# EAGLE design MainBoardRev2 (EAGLE 9.6.2)

## Sheet 1 of 2: Schrittmotorsteuerung Hier wird die Schaltung für die Schrittmotortreiber aufgezeigt
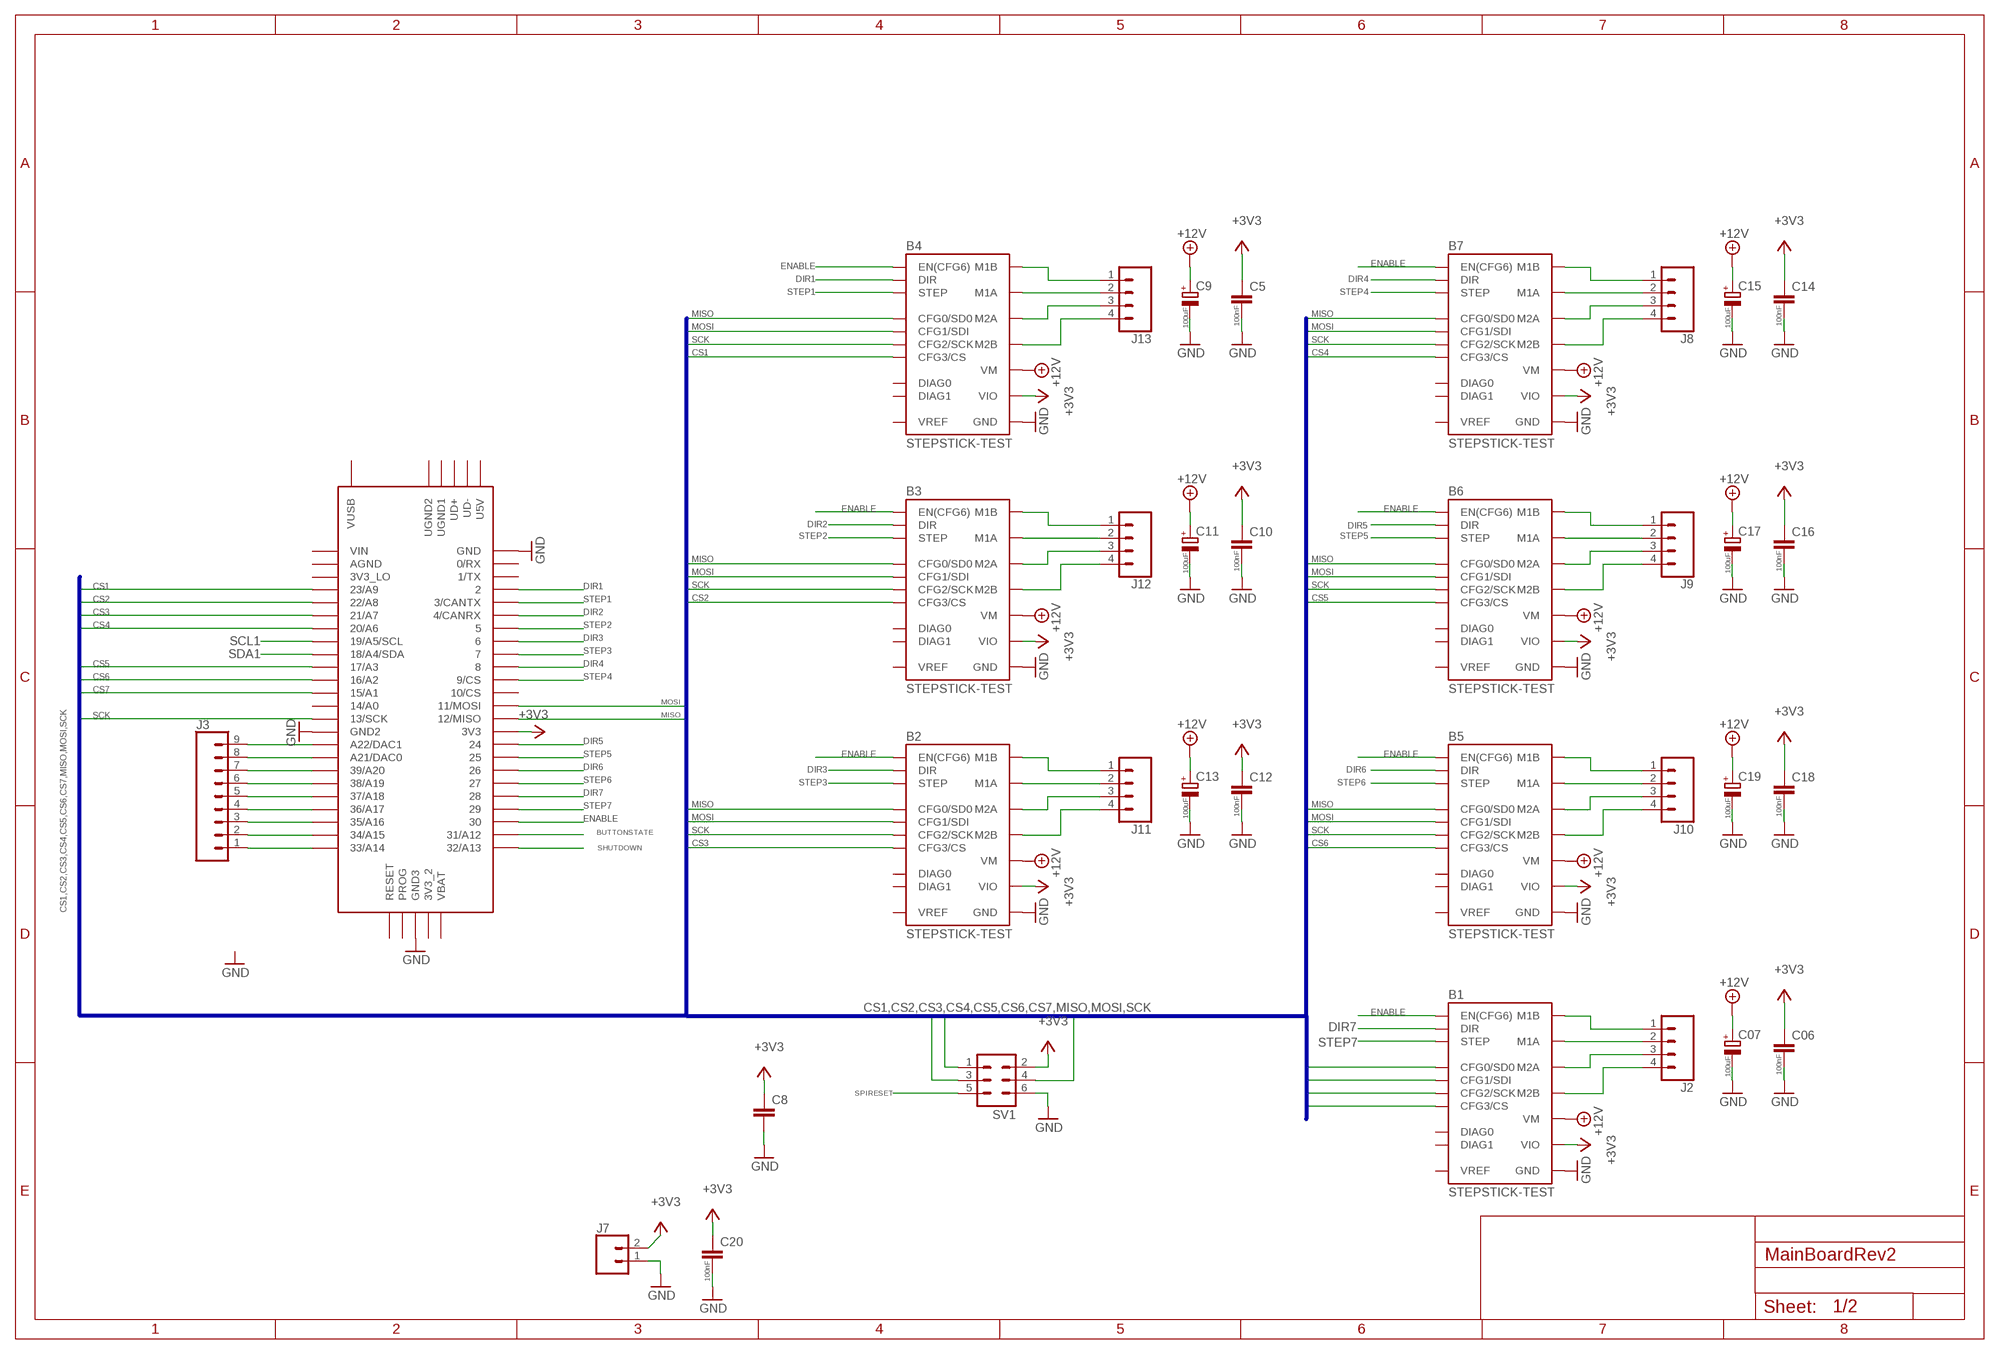
[diagram p0: schematic, sheet 1]

### Parts
B1  STEPSTICK-TEST  [STEPSTICK-TEST]
B2  STEPSTICK-TEST  [STEPSTICK-TEST]
B3  STEPSTICK-TEST  [STEPSTICK-TEST]
B4  STEPSTICK-TEST  [STEPSTICK-TEST]
B5  STEPSTICK-TEST  [STEPSTICK-TEST]
B6  STEPSTICK-TEST  [STEPSTICK-TEST]
B7  STEPSTICK-TEST  [STEPSTICK-TEST]
C5  100nF  C-EU050-024X044  [C050-024X044]
C06  100nF  C-EU050-024X044  [C050-024X044]
C07  100uF  CPOL-EUE2.5-6  [E2,5-6]
C8  C-EU050-024X044  [C050-024X044]
C9  100uF  CPOL-EUE2.5-6  [E2,5-6]
C10  100nF  C-EU050-024X044  [C050-024X044]
C11  100uF  CPOL-EUE2.5-6  [E2,5-6]
C12  100nF  C-EU050-024X044  [C050-024X044]
C13  100uF  CPOL-EUE2.5-6  [E2,5-6]
C14  100nF  C-EU050-024X044  [C050-024X044]
C15  100uF  CPOL-EUE2.5-6  [E2,5-6]
C16  100nF  C-EU050-024X044  [C050-024X044]
C17  100uF  CPOL-EUE2.5-6  [E2,5-6]
C18  100nF  C-EU050-024X044  [C050-024X044]
C19  100uF  CPOL-EUE2.5-6  [E2,5-6]
C20  100nF  C-EU050-024X044  [C050-024X044]
J2  CONN_041X04_NO_SILK  [1X04_NO_SILK]
J3  CONN_09LONGPADS  [1X09_LONGPADS]
J7  CONN_02PTH3  [1X02_LONGPADS]
J8  CONN_041X04_NO_SILK  [1X04_NO_SILK]
J9  CONN_041X04_NO_SILK  [1X04_NO_SILK]
J10  CONN_041X04_NO_SILK  [1X04_NO_SILK]
J11  CONN_041X04_NO_SILK  [1X04_NO_SILK]
J12  CONN_041X04_NO_SILK  [1X04_NO_SILK]
J13  CONN_041X04_NO_SILK  [1X04_NO_SILK]
SV1  MA03-2  [MA03-2]
U$1  TEENSY_4.1  [TEENSY_4.1]

### Nets
+3V3: B1.VIO B2.VIO B3.VIO B4.VIO B5.VIO B6.VIO B7.VIO C5.1 C06.1 C8.1 C10.1 C12.1 C14.1 C16.1 C18.1 C20.1 J7.2 SV1.2 U$1.3V3 ; also sheet 2
+12V: B1.VM B2.VM B3.VM B4.VM B5.VM B6.VM B7.VM C07.+ C9.+ C11.+ C13.+ C15.+ C17.+ C19.+ ; also sheet 2
BUTTONSTATE: U$1.31/A12 ; also sheet 2
CS1: B4.CFG3(CFG3/CS) U$1.23/A9
CS2: B3.CFG3(CFG3/CS) U$1.22/A8
CS3: B2.CFG3(CFG3/CS) U$1.21/A7
CS4: B7.CFG3(CFG3/CS) U$1.20/A6
CS5: B6.CFG3(CFG3/CS) U$1.17/A3
CS6: B5.CFG3(CFG3/CS) U$1.16/A2
CS7: B1.CFG3(CFG3/CS) U$1.15/A1
DIR1: B4.DIR U$1.2
DIR2: B3.DIR U$1.4/CANRX
DIR3: B2.DIR U$1.6
DIR4: B7.DIR U$1.8
DIR5: B6.DIR U$1.24/A10
DIR6: B5.DIR U$1.26/12
DIR7: B1.DIR U$1.28
ENABLE: B1.EN(EN(CFG6)) B2.EN(EN(CFG6)) B3.EN(EN(CFG6)) B4.EN(EN(CFG6)) B5.EN(EN(CFG6)) B6.EN(EN(CFG6)) B7.EN(EN(CFG6)) U$1.30
GND: B1.GND@1(GND) B1.GND@2(GND) B2.GND@1(GND) B2.GND@2(GND) B3.GND@1(GND) B3.GND@2(GND) B4.GND@1(GND) B4.GND@2(GND) B5.GND@1(GND) B5.GND@2(GND) B6.GND@1(GND) B6.GND@2(GND) B7.GND@1(GND) B7.GND@2(GND) C5.2 C06.2 C07.- C8.2 C9.- C10.2 C11.- C12.2 C13.- C14.2 C15.- C16.2 C17.- C18.2 C19.- C20.2 J7.1 SV1.6 U$1.GND U$1.GND2 U$1.GND3 ; also sheet 2
MISO: B1.NC/CFG0(CFG0/SD0) B2.NC/CFG0(CFG0/SD0) B3.NC/CFG0(CFG0/SD0) B4.NC/CFG0(CFG0/SD0) B5.NC/CFG0(CFG0/SD0) B6.NC/CFG0(CFG0/SD0) B7.NC/CFG0(CFG0/SD0) SV1.1 U$1.12/MISO
MOSI: B1.CFG1(CFG1/SDI) B2.CFG1(CFG1/SDI) B3.CFG1(CFG1/SDI) B4.CFG1(CFG1/SDI) B5.CFG1(CFG1/SDI) B6.CFG1(CFG1/SDI) B7.CFG1(CFG1/SDI) SV1.4 U$1.11/MOSI
N$1: B1.M2B J2.4
N$2: B1.M2A J2.3
N$3: B1.M1A J2.2
N$7: B1.M1B J2.1
N$8: J3.1 U$1.33/A14
N$9: J3.2 U$1.34/A15
N$10: J3.3 U$1.35/A16
N$11: J3.4 U$1.36/A17
N$12: J3.5 U$1.37/A18
N$13: J3.6 U$1.38/A19
N$14: B2.M2B J11.4
N$15: B2.M2A J11.3
N$16: B2.M1A J11.2
N$17: B2.M1B J11.1
N$18: B3.M2B J12.4
N$19: B3.M2A J12.3
N$20: B3.M1A J12.2
N$21: B3.M1B J12.1
N$22: B4.M2B J13.4
N$23: B4.M2A J13.3
N$24: B4.M1A J13.2
N$25: B4.M1B J13.1
N$26: B5.M2B J10.4
N$27: B5.M2A J10.3
N$28: B5.M1A J10.2
N$29: B5.M1B J10.1
N$30: B6.M2B J9.4
N$31: B6.M2A J9.3
N$32: B6.M1A J9.2
N$33: B6.M1B J9.1
N$34: B7.M2B J8.4
N$35: B7.M2A J8.3
N$36: B7.M1A J8.2
N$37: B7.M1B J8.1
N$38: J3.7 U$1.39/A20
N$39: J3.8 U$1.21/DAC0(A21/DAC0)
N$40: J3.9 U$1.A22/DAC1
SCK: B1.CFG2(CFG2/SCK) B2.CFG2(CFG2/SCK) B3.CFG2(CFG2/SCK) B4.CFG2(CFG2/SCK) B5.CFG2(CFG2/SCK) B6.CFG2(CFG2/SCK) B7.CFG2(CFG2/SCK) SV1.3 U$1.13/SCK
SCL1: U$1.19/A5/SCL ; also sheet 2
SDA1: U$1.18/A4/SDA ; also sheet 2
SHUTDOWN: U$1.32/A13 ; also sheet 2
SPIRESET: SV1.5
STEP1: B4.STEP U$1.3/CANTX
STEP2: B3.STEP U$1.5
STEP3: B2.STEP U$1.7
STEP4: B7.STEP U$1.9/CS
STEP5: B6.STEP U$1.25/A11
STEP6: B5.STEP U$1.27/A13
STEP7: B1.STEP U$1.29
Unconnected: B1.DIAG0 B1.DIAG1 B1.VREF B2.DIAG0 B2.DIAG1 B2.VREF B3.DIAG0 B3.DIAG1 B3.VREF B4.DIAG0 B4.DIAG1 B4.VREF B5.DIAG0 B5.DIAG1 B5.VREF B6.DIAG0 B6.DIAG1 B6.VREF B7.DIAG0 B7.DIAG1 B7.VREF U$1.0/RX U$1.1/TX U$1.3V3_2 U$1.3V3_LO U$1.10/CS U$1.14/A0 U$1.AGND U$1.PROG U$1.RESET U$1.U5V U$1.UD+ U$1.UD- U$1.UGND1 U$1.UGND2 U$1.VBAT U$1.VIN U$1.VUSB

### Buses
CS1,CS2,CS3,CS4,CS5,CS6,CS7,MISO,MOSI,SCK

## Sheet 2 of 2: Spannungsversorgung Hier wird das Powerup-Interface des Netzteils definiert
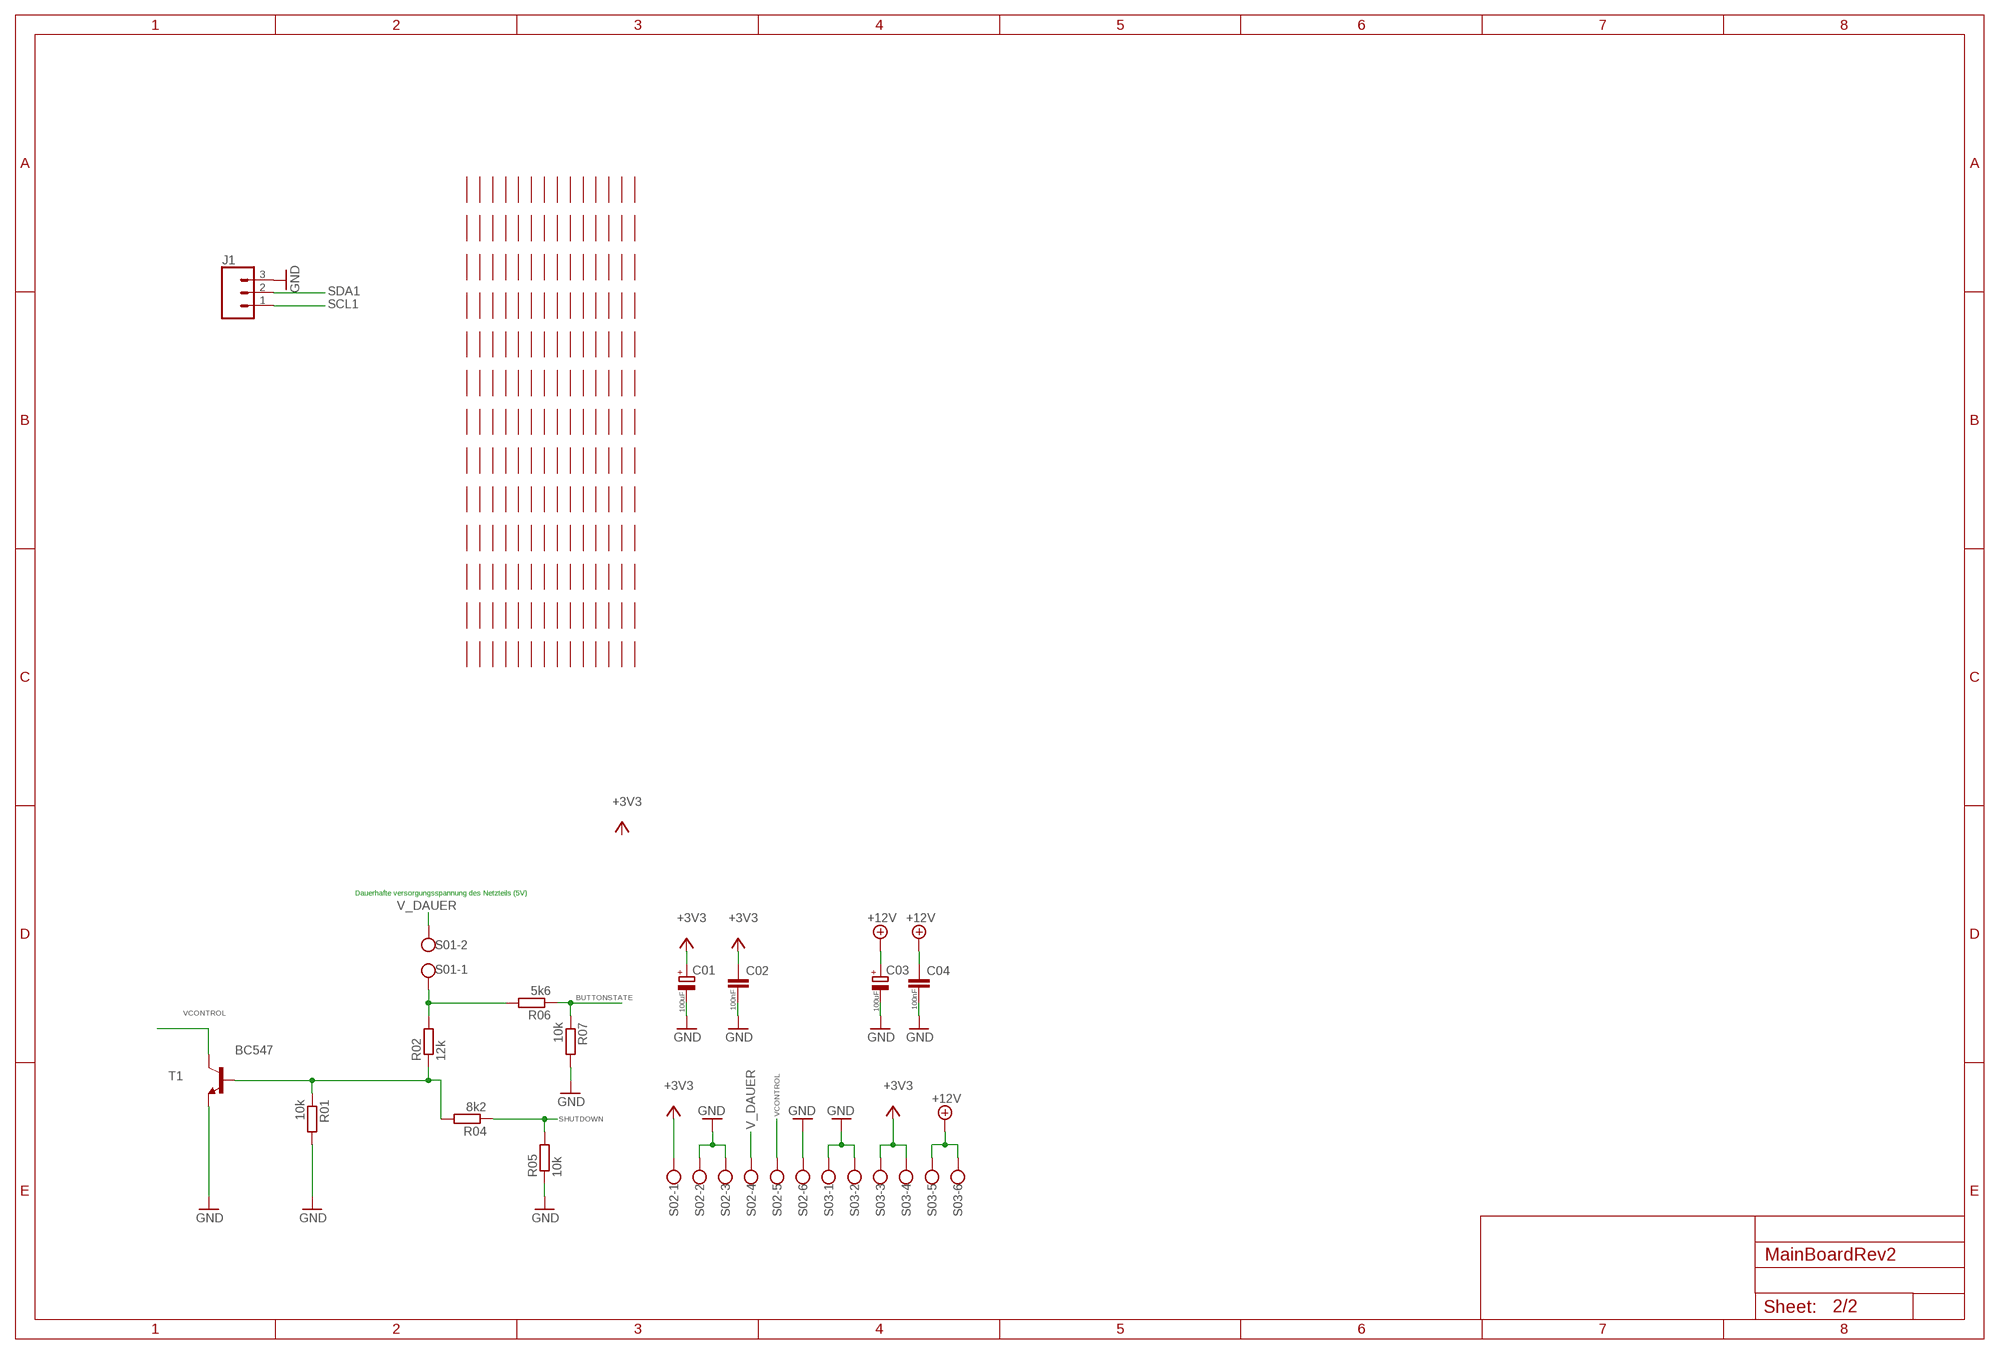
[diagram p1: schematic, sheet 2]

### Parts
C01  100uF  CPOL-EUE2.5-6  [E2,5-6]
C02  100nF  C-EU050-024X044  [C050-024X044]
C03  100uF  CPOL-EUE2.5-6  [E2,5-6]
C04  100nF  C-EU050-024X044  [C050-024X044]
J1  CONN_03LONGPADS  [1X03_LONGPADS]
R01  10k  R-EU_0207/10  [0207/10]
R02  12k  R-EU_0207/10  [0207/10]
R04  8k2  R-EU_0207/10  [0207/10]
R05  10k  R-EU_0207/10  [0207/10]
R06  5k6  R-EU_0207/10  [0207/10]
R07  10k  R-EU_0207/10  [0207/10]
S01  W237-102  [W237-102]
S02  W237-6  [W237-6]
S03  W237-6  [W237-6]
T1  BC547  [TO92]
U$2  LOCHRASTER  [LOCHRASTER]

### Nets
+3V3: C01.+ C02.1 S02.1 S03.3 S03.4 ; also sheet 1
+12V: C03.+ C04.1 S03.5 S03.6 ; also sheet 1
BUTTONSTATE: R06.1 R07.1 ; also sheet 1
GND: C01.- C02.2 C03.- C04.2 J1.3 R01.2 R05.1 R07.2 S02.2 S02.3 S02.6 S03.1 S03.2 T1.1(E) ; also sheet 1
N$5: R02.2 R06.2 S01.1
N$41: R01.1 R02.1 R04.2 T1.2(B)
SCL1: J1.1 ; also sheet 1
SDA1: J1.2 ; also sheet 1
SHUTDOWN: R04.1 R05.2 ; also sheet 1
V_DAUER: S01.2 S02.4
VCONTROL: S02.5 T1.3(C)
Unconnected: U$2.P$1 U$2.P$2 U$2.P$3 U$2.P$4 U$2.P$5 U$2.P$6 U$2.P$7 U$2.P$8 U$2.P$9 U$2.P$10 U$2.P$11 U$2.P$12 U$2.P$13 U$2.P$14 U$2.P$15 U$2.P$16 U$2.P$17 U$2.P$18 U$2.P$19 U$2.P$20 U$2.P$21 U$2.P$22 U$2.P$23 U$2.P$24 U$2.P$25 U$2.P$26 U$2.P$27 U$2.P$28 U$2.P$29 U$2.P$30 U$2.P$31 U$2.P$32 U$2.P$33 U$2.P$34 U$2.P$35 U$2.P$36 U$2.P$37 U$2.P$38 U$2.P$39 U$2.P$40 U$2.P$41 U$2.P$42 U$2.P$43 U$2.P$44 U$2.P$45 U$2.P$46 U$2.P$47 U$2.P$48 U$2.P$49 U$2.P$50 U$2.P$51 U$2.P$52 U$2.P$53 U$2.P$54 U$2.P$55 U$2.P$56 U$2.P$57 U$2.P$58 U$2.P$59 U$2.P$60 U$2.P$61 U$2.P$62 U$2.P$63 U$2.P$64 U$2.P$65 U$2.P$66 U$2.P$67 U$2.P$68 U$2.P$69 U$2.P$70 U$2.P$71 U$2.P$72 U$2.P$73 U$2.P$74 U$2.P$75 U$2.P$76 U$2.P$77 U$2.P$78 U$2.P$79 U$2.P$80 U$2.P$81 U$2.P$82 U$2.P$83 U$2.P$84 U$2.P$85 U$2.P$86 U$2.P$87 U$2.P$88 U$2.P$89 U$2.P$90 U$2.P$91 U$2.P$92 U$2.P$93 U$2.P$94 U$2.P$95 U$2.P$96 U$2.P$97 U$2.P$98 U$2.P$99 U$2.P$100 U$2.P$101 U$2.P$102 U$2.P$103 U$2.P$104 U$2.P$105 U$2.P$106 U$2.P$107 U$2.P$108 U$2.P$109 U$2.P$110 U$2.P$111 U$2.P$112 U$2.P$113 U$2.P$114 U$2.P$115 U$2.P$116 U$2.P$117 U$2.P$118 U$2.P$119 U$2.P$120 U$2.P$121 U$2.P$122 U$2.P$123 U$2.P$124 U$2.P$125 U$2.P$126 U$2.P$127 U$2.P$128 U$2.P$129 U$2.P$130 U$2.P$131 U$2.P$132 U$2.P$133 U$2.P$134 U$2.P$135 U$2.P$136 U$2.P$137 U$2.P$138 U$2.P$139 U$2.P$140 U$2.P$141 U$2.P$142 U$2.P$143 U$2.P$144 U$2.P$145 U$2.P$146 U$2.P$147 U$2.P$148 U$2.P$149 U$2.P$150 U$2.P$151 U$2.P$152 U$2.P$153 U$2.P$154 U$2.P$155 U$2.P$156 U$2.P$157 U$2.P$158 U$2.P$159 U$2.P$160 U$2.P$161 U$2.P$162 U$2.P$163 U$2.P$164 U$2.P$165 U$2.P$166 U$2.P$167 U$2.P$168 U$2.P$169 U$2.P$170 U$2.P$171 U$2.P$172 U$2.P$173 U$2.P$174 U$2.P$175 U$2.P$176 U$2.P$177 U$2.P$178 U$2.P$179 U$2.P$180 U$2.P$181 U$2.P$182

### Notes on the sheet
- Dauerhafte versorgungsspannung des Netzteils (5V)

## Library data of the parts
B1-B7 = we-board:STEPSTICK: SilentStepStick - Trinamic TMC2100/TMC2130 Stepper Motor Driver TMC2100 - CFG pins for configuration TMC2130 - SPI for configuration Pin CFG0/SDO only available on TMC2130 SilentStepStick.
C01 C03 C07 C9 C11 C13 C15 C17 C19 = rclTH:CPOL-EU: POLARIZED CAPACITOR, European symbol; SPICEPREFIX: C
C02 C04 C5 C06 C8 C10 C12 C14 C16 C18 C20 = rclTH:C-EU: CAPACITOR, European symbol; SPICEPREFIX: C
J1 = SparkFun-Connectors:CONN_03: Multi connection point. Often used as Generic Header-pin footprint for 0.1 inch spaced/style header connections On any of the 0.1 inch spaced packages, you can populate with these: Break Away Headers - Straight <https://www.sparkfun.com/products/116> (PRT-00116) Break Away Male Headers - Right Angle <https://www.sparkfun.com/products/553> (PRT-00553) Female Headers <https://www.sparkfun.com/products/115> (PRT-00115) Break Away Headers - Machine Pin <https://www.sparkfun.com/products/117> (PRT-00117) Break Away Female Headers - Swiss Machine Pin <https://www.sparkfun.com/products/743> (PRT-00743) Stackable Header - 3 Pin (Female, 0.1") <https://www.sparkfun.com/products/13875> (PRT-13875) For SCREWTERMINALS and SPRING TERMINALS visit here: Screw Terimnals on SparkFun.com <https://www.sparkfun.com/search/results?term=Screw+Terminals> (5mm/3.5mm/2.54mm spacing) This device is also useful as a general connection point to wire up your design to another part of your project. Our various solder wires solder well into these plated through hole pads. Hook-Up Wire - Assortment (Stranded, 22 AWG) <https://www.sparkfun.com/products/11375> (PRT-11375) Hook-Up Wire - Assortment (Solid Core, 22 AWG) <https://www.sparkfun.com/products/11367> (PRT-11367) View the entire wire category on our website here <https://www.sparkfun.com/categories/141> Special notes: Molex polarized connector foot print use with SKU : PRT-08232 with associated crimp pins and housings.
J2 J8-J13 = SparkFun-Connectors:CONN_04: Multi connection point. Often used as Generic Header-pin footprint for 0.1 inch spaced/style header connections On any of the 0.1 inch spaced packages, you can populate with these: Break Away Headers - Straight <https://www.sparkfun.com/products/116> (PRT-00116) Break Away Male Headers - Right Angle <https://www.sparkfun.com/products/553> (PRT-00553) Female Headers <https://www.sparkfun.com/products/115> (PRT-00115) Break Away Headers - Machine Pin <https://www.sparkfun.com/products/117> (PRT-00117) Break Away Female Headers - Swiss Machine Pin <https://www.sparkfun.com/products/743> (PRT-00743) For SCREWTERMINALS and SPRING TERMINALS visit here: Screw Terimnals on SparkFun.com <https://www.sparkfun.com/search/results?term=Screw+Terminals> (5mm/3.5mm/2.54mm spacing) This device is also useful as a general connection point to wire up your design to another part of your project. Our various solder wires solder well into these plated through hole pads. Hook-Up Wire - Assortment (Stranded, 22 AWG) <https://www.sparkfun.com/products/11375> (PRT-11375) Hook-Up Wire - Assortment (Solid Core, 22 AWG) <https://www.sparkfun.com/products/11367> (PRT-11367) View the entire wire category on our website here <https://www.sparkfun.com/categories/141> Special notes: Molex polarized connector foot print use with SKU : PRT-08231 with associated crimp pins and housings. 1MM SMD Version SKU: PRT-10208; PROD_ID: CONN-09696
J3 = SparkFun-Connectors:CONN_09: Multi connection point. Often used as Generic Header-pin footprint for 0.1 inch spaced/style header connections On any of the 0.1 inch spaced packages, you can populate with these: Break Away Headers - Straight <https://www.sparkfun.com/products/116> (PRT-00116) Break Away Male Headers - Right Angle <https://www.sparkfun.com/products/553> (PRT-00553) Female Headers <https://www.sparkfun.com/products/115> (PRT-00115) Break Away Headers - Machine Pin <https://www.sparkfun.com/products/117> (PRT-00117) Break Away Female Headers - Swiss Machine Pin <https://www.sparkfun.com/products/743> (PRT-00743) For SCREWTERMINALS and SPRING TERMINALS visit here: Screw Terimnals on SparkFun.com <https://www.sparkfun.com/search/results?term=Screw+Terminals> (5mm/3.5mm/2.54mm spacing) This device is also useful as a general connection point to wire up your design to another part of your project. Our various solder wires solder well into these plated through hole pads. Hook-Up Wire - Assortment (Stranded, 22 AWG) <https://www.sparkfun.com/products/11375> (PRT-11375) Hook-Up Wire - Assortment (Solid Core, 22 AWG) <https://www.sparkfun.com/products/11367> (PRT-11367) View the entire wire category on our website here <https://www.sparkfun.com/categories/141> Special notes: Molex polarized connector foot print use with SKU : PRT-08231 with associated crimp pins and housings. 1MM SMD Version SKU: PRT-10208 NOTES ON THE VARIANTS LOCK and LOCK_LONGPADS... This footprint was designed to help hold the alignment of a through-hole component (i.e. 6-pin header) while soldering it into place. You may notice that each hole has been shifted either up or down by 0.005 of an inch from it's more standard position (which is a perfectly straight line). This slight alteration caused the pins (the squares in the middle) to touch the edges of the holes. Because they are alternating, it causes a "brace" to hold the component in place. 0.005 has proven to be the perfect amount of "off-center" position when using our standard breakaway headers. Although looks a little odd when you look at the bare footprint, once you have a header in there, the alteration is very hard to notice. Also,if you push a header all the way into place, it is covered up entirely on the bottom side.
J7 = SparkFun-Connectors:CONN_02: Multi connection point. Often used as Generic Header-pin footprint for 0.1 inch spaced/style header connections On any of the 0.1 inch spaced packages, you can populate with these: Break Away Headers - Straight <https://www.sparkfun.com/products/116> (PRT-00116) Break Away Male Headers - Right Angle <https://www.sparkfun.com/products/553> (PRT-00553) Female Headers <https://www.sparkfun.com/products/115> (PRT-00115) Break Away Headers - Machine Pin <https://www.sparkfun.com/products/117> (PRT-00117) Break Away Female Headers - Swiss Machine Pin <https://www.sparkfun.com/products/743> (PRT-00743) For SCREWTERMINALS and SPRING TERMINALS visit here: Screw Terimnals on SparkFun.com <https://www.sparkfun.com/search/results?term=Screw+Terminals> (5mm/3.5mm/2.54mm spacing) This device is also useful as a general connection point to wire up your design to another part of your project. Our various solder wires solder well into these plated through hole pads. Hook-Up Wire - Assortment (Stranded, 22 AWG) <https://www.sparkfun.com/products/11375> (PRT-11375) Hook-Up Wire - Assortment (Solid Core, 22 AWG) <https://www.sparkfun.com/products/11367> (PRT-11367) View the entire wire category on our website here <https://www.sparkfun.com/categories/141> Special notes: Molex polarized connector foot print use with: PRT-08233 with associated crimp pins and housings. 2.54_SCREWTERM for use with PRT-10571. 3.5mm Screw Terminal footprints for PRT-08084 5mm Screw Terminal footprints for use with PRT-08432
R01 R02 R04-R07 = rcl:R-EU_: RESISTOR, European symbol; SPICEPREFIX: R
S01 = con-wago-500_3D:W237-102: WAGO SCREW CLAMP; MPN: 237-102; OC_FARNELL: unknown; OC_NEWARK: 70K9898
S02 S03 = con-wago-500_3D:W237-6: WAGO SCREW CLAMP; OC_FARNELL: unknown; OC_NEWARK: unknown
SV1 = con-lstb:MA03-2: PIN HEADER; OC_FARNELL: unknown; OC_NEWARK: unknown
T1 = transistor:BC547: NPN TRANSISTOR
U$1 = Teensy356:TEENSY_4.1
U$2 = _Elektrokiste:LOCHRASTER

## Board
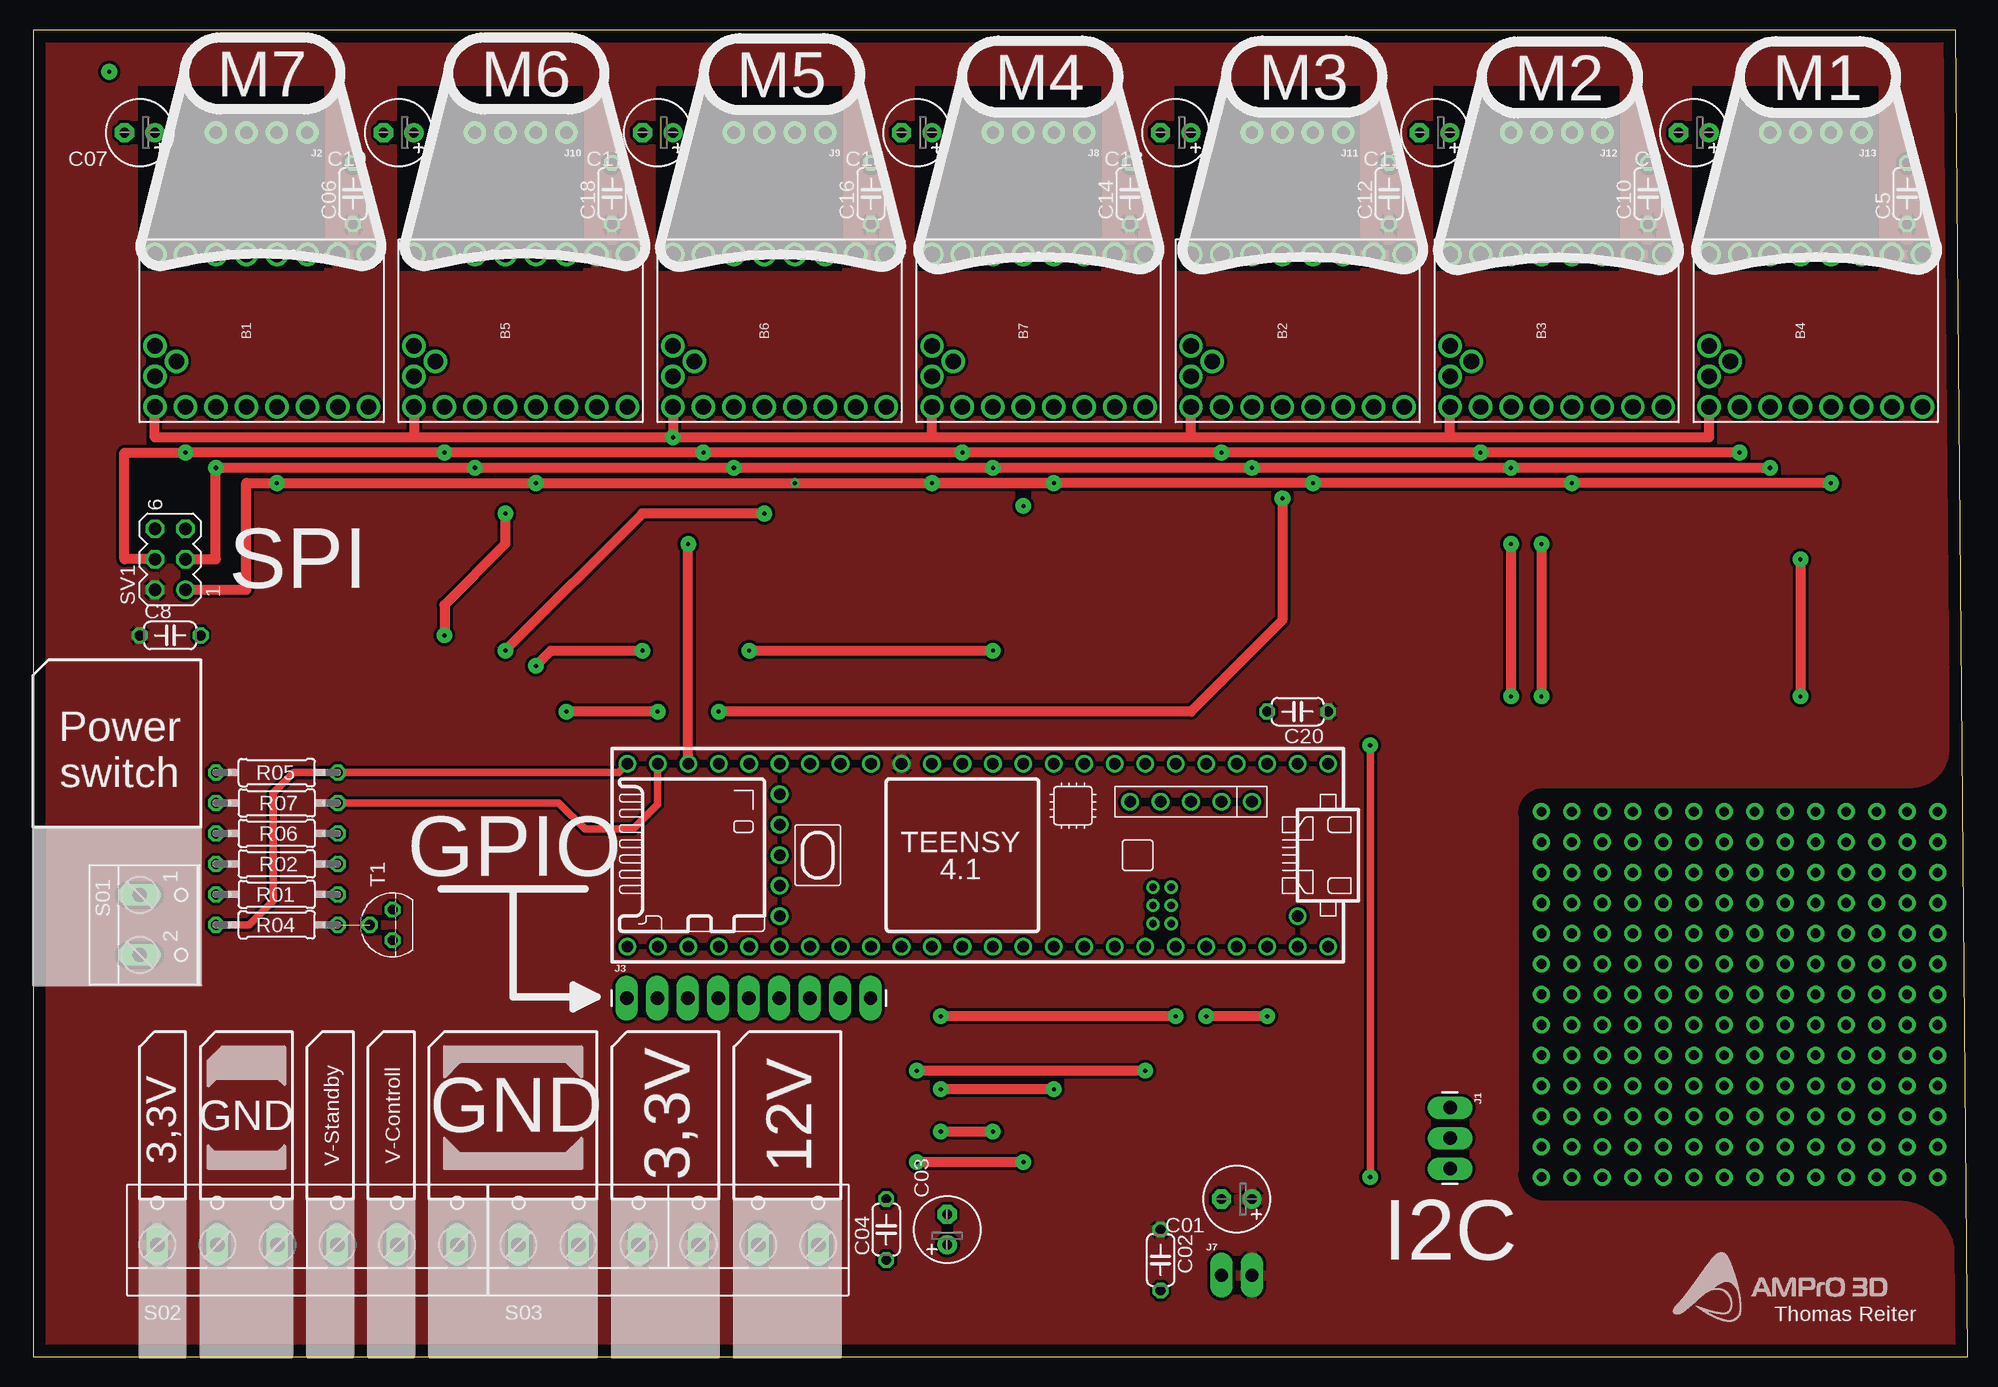
[diagram p2: board, top side]
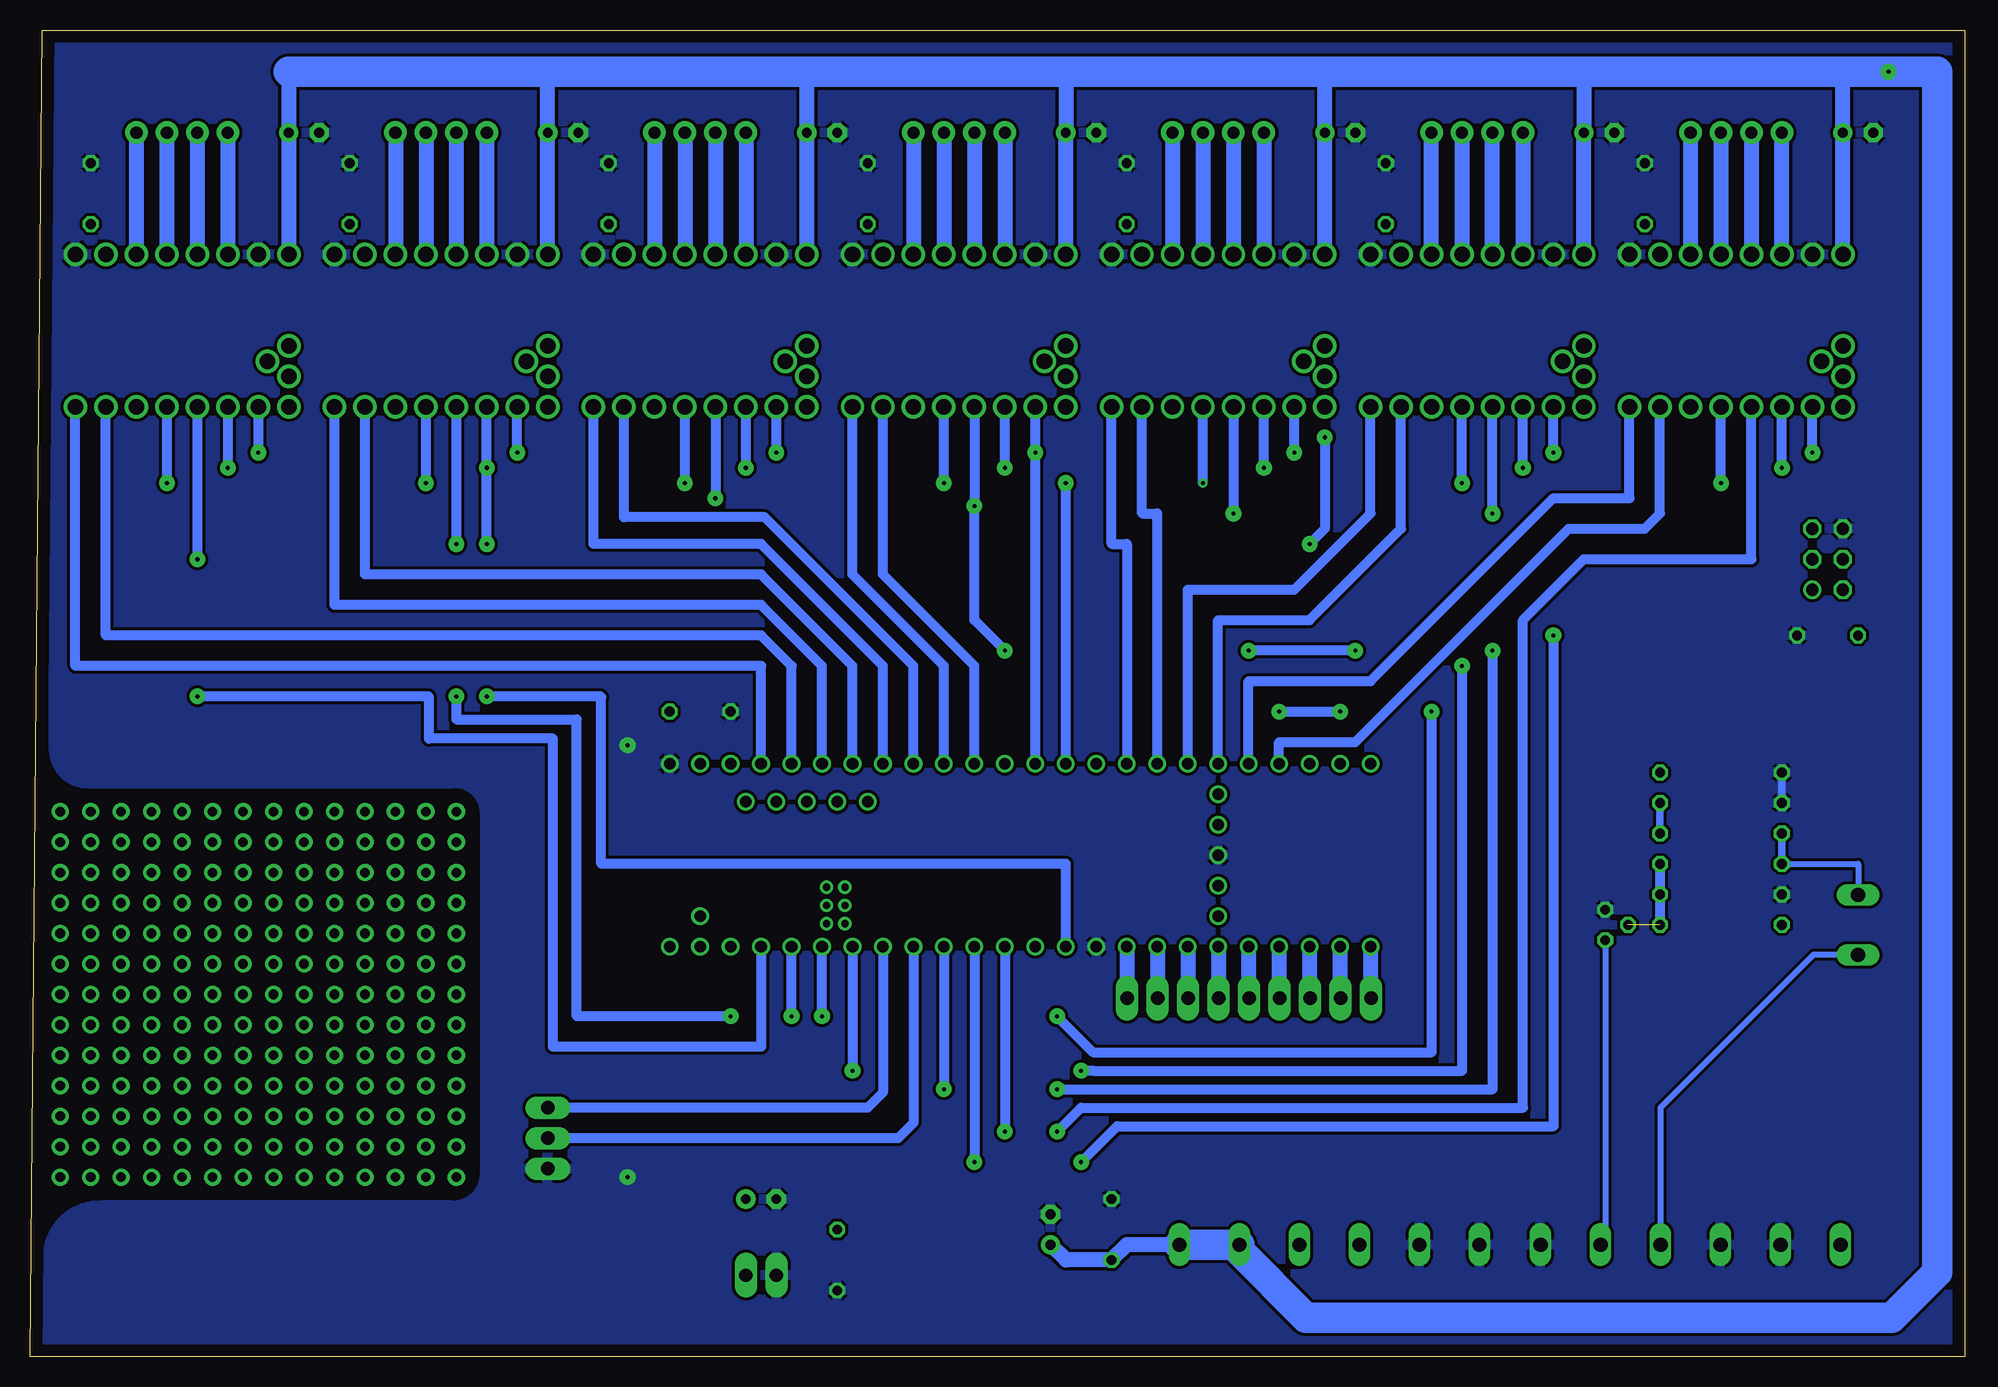
[diagram p3: board, bottom side, seen from below]

Size 161.27 x 110.62 mm. Coordinates in mm from the lower left corner, seen from the top.
Outline: 0,110.62 0,0 161.27,0 160.27,110.62 0,110.62
Copper layers (1*16): Top 0.035mm / dielectric 1.5mm / Bottom 0.035mm
Design rules "default": minimum track width 6mil, minimum drill 0.35mm, track to track 6mil, track to pad 6mil, pad to pad 6mil, via to via 6mil, smd to smd 6mil, copper to edge 40mil, drill to drill 6mil, minimum pad ring 10mil, minimum via ring 8mil, stop-mask expansion 4mil, vias tented up to drill 0mil, thermal gap 10mil
tRestrict: area 124.5,8.3 to 167.6,53.3
bRestrict: area 124.5,8.3 to 167.6,53.3

### Footprints (pad centres in the part's own frame; a part is rotated, then mirrored left to right if it is on the bottom)
STEPSTICK-TEST = drill 1.3 pad 1.9: CFG1 -6.35,6.35; CFG2 -6.35,3.81; CFG3 -6.35,1.27; DIAG0 -2.54,7.112; DIAG1 -1.27,8.89; DIR -6.35,-8.89; EN -6.35,8.89; GND@1 6.35,6.35; GND@2 6.35,-8.89; M1A 6.35,-1.27; M1B 6.35,-3.81; M2A 6.35,1.27; M2B 6.35,3.81; NC -6.35,-3.81; NC/CFG0 -6.35,-1.27; STEP -6.35,-6.35; VIO 6.35,-6.35; VM 6.35,8.89; VREF -3.81,8.89
E2,5-6 = drill 0.813 pad 1.6: + -1.27,0 | drill 0.813 pad 1.6 octagon: - 1.27,0
C050-024X044 = drill 0.813 octagon: 1 -2.54,0; 2 2.54,0
1X03_LONGPADS = drill 1.118 pad 1.88 long: 1 0,0; 2 2.54,0; 3 5.08,0
1X04_NO_SILK = drill 1.016 pad 1.88: 1 0,0; 2 2.54,0; 3 5.08,0; 4 7.62,0
1X09_LONGPADS = drill 1.118 pad 1.88 long: 1 0,0; 2 2.54,0; 3 5.08,0; 4 7.62,0; 5 10.16,0; 6 12.7,0; 7 15.24,0; 8 17.78,0; 9 20.32,0
1X02_LONGPADS = drill 1.118 pad 1.88 long: 1 0,0; 2 2.54,0
0207/10 = drill 0.813 octagon: 1 -5.08,0; 2 5.08,0
W237-102 = drill 1.194 long: 1 -2.5,-1.27; 2 2.5,-1.27
W237-6 = drill 1.194 long: 1 -12.5,-1.27; 2 -7.5,-1.27; 3 -2.5,-1.27; 4 2.5,-1.27; 5 7.5,-1.27; 6 12.5,-1.27
MA03-2 = drill 1.016: 1 -2.54,-1.27 | drill 1.016 octagon: 2 -2.54,1.27; 3 0,-1.27; 4 0,1.27; 5 2.54,-1.27; 6 2.54,1.27
TO92 = drill 0.813 octagon: 1 1.27,0; 2 0,1.905; 3 -1.27,0
TEENSY_4.1 = drill 0.965: 0/RX -25.4,-7.62; 1/TX -22.86,-7.62; 2 -20.32,-7.62; 3/CANTX -17.78,-7.62; 3V3 7.62,-7.62; 3V3_2 17.78,-2.54; 3V3_LO -22.86,7.62; 4/CANRX -15.24,-7.62; 5 -12.7,-7.62; 6 -10.16,-7.62; 7 -7.62,-7.62; 8 -5.08,-7.62; 9/CS -2.54,-7.62; 10/CS 0,-7.62; 11/MOSI 2.54,-7.62; 12/MISO 5.08,-7.62; 13/SCK 5.08,7.62; 14/A0 2.54,7.62; 15/A1 0,7.62; 16/A2 -2.54,7.62; 17/A3 -5.08,7.62; 18/A4/SDA -7.62,7.62; 19/A5/SCL -10.16,7.62; 20/A6 -12.7,7.62; 21/A7 -15.24,7.62; 21/DAC0 12.7,7.62; 22/A8 -17.78,7.62; 23/A9 -20.32,7.62; 24/A10 10.16,-7.62; 25/A11 12.7,-7.62; 26/12 15.24,-7.62; 27/A13 17.78,-7.62; 28 20.32,-7.62; 29 22.86,-7.62; 30 25.4,-7.62; 31/A12 27.94,-7.62; 32/A13 30.48,-7.62; 33/A14 30.48,7.62; 34/A15 27.94,7.62; 35/A16 25.4,7.62; 36/A17 22.86,7.62; 37/A18 20.32,7.62; 38/A19 17.78,7.62; 39/A20 15.24,7.62; A22/DAC1 10.16,7.62; AGND -25.4,7.62; GND -27.94,-7.62; GND2 7.62,7.62; GND3 17.78,0; PROG 17.78,2.54; RESET 17.78,5.08; U5V -21.59,-4.445; UD+ -16.51,-4.445; UD- -19.05,-4.445; UGND1 -13.97,-4.445; UGND2 -11.43,-4.445; VBAT 17.78,-5.08; VIN -27.94,7.62; VUSB -25.4,5.08 | drill 0.6: P$1 -14.859,5.715; P$2 -13.335,5.715; P$3 -14.859,4.191; P$4 -13.335,4.191; P$5 -14.859,2.667; P$6 -13.335,2.667
LOCHRASTER = drill 0.8 pad 1.422: P$1 0,0; P$2 2.54,0; P$3 5.08,0; P$4 7.62,0; P$5 10.16,0; P$6 12.7,0; P$7 15.24,0; P$8 17.78,0; P$9 20.32,0; P$10 22.86,0; P$11 25.4,0; P$12 27.94,0; P$13 30.48,0; P$14 33.02,0; P$15 0,-2.54; P$16 2.54,-2.54; P$17 5.08,-2.54; P$18 7.62,-2.54; P$19 10.16,-2.54; P$20 12.7,-2.54; P$21 15.24,-2.54; P$22 17.78,-2.54; P$23 20.32,-2.54; P$24 22.86,-2.54; P$25 25.4,-2.54; P$26 27.94,-2.54; P$27 30.48,-2.54; P$28 33.02,-2.54; P$29 0,-5.08; P$30 2.54,-5.08; P$31 5.08,-5.08; P$32 7.62,-5.08; P$33 10.16,-5.08; P$34 12.7,-5.08; P$35 15.24,-5.08; P$36 17.78,-5.08; P$37 20.32,-5.08; P$38 22.86,-5.08; P$39 25.4,-5.08; P$40 27.94,-5.08; P$41 30.48,-5.08; P$42 33.02,-5.08; P$43 0,-7.62; P$44 2.54,-7.62; P$45 5.08,-7.62; P$46 7.62,-7.62; P$47 10.16,-7.62; P$48 12.7,-7.62; P$49 15.24,-7.62; P$50 17.78,-7.62; P$51 20.32,-7.62; P$52 22.86,-7.62; P$53 25.4,-7.62; P$54 27.94,-7.62; P$55 30.48,-7.62; P$56 33.02,-7.62; P$57 0,-10.16; P$58 2.54,-10.16; P$59 5.08,-10.16; P$60 7.62,-10.16; P$61 10.16,-10.16; P$62 12.7,-10.16; P$63 15.24,-10.16; P$64 17.78,-10.16; P$65 20.32,-10.16; P$66 22.86,-10.16; P$67 25.4,-10.16; P$68 27.94,-10.16; P$69 30.48,-10.16; P$70 33.02,-10.16; P$71 0,-12.7; P$72 2.54,-12.7; P$73 5.08,-12.7; P$74 7.62,-12.7; P$75 10.16,-12.7; P$76 12.7,-12.7; P$77 15.24,-12.7; P$78 17.78,-12.7; P$79 20.32,-12.7; P$80 22.86,-12.7; P$81 25.4,-12.7; P$82 27.94,-12.7; P$83 30.48,-12.7; P$84 33.02,-12.7; P$85 0,-15.24; P$86 2.54,-15.24; P$87 5.08,-15.24; P$88 7.62,-15.24; P$89 10.16,-15.24; P$90 12.7,-15.24; P$91 15.24,-15.24; P$92 17.78,-15.24; P$93 20.32,-15.24; P$94 22.86,-15.24; P$95 25.4,-15.24; P$96 27.94,-15.24; P$97 30.48,-15.24; P$98 33.02,-15.24; P$99 0,-17.78; P$100 2.54,-17.78; P$101 5.08,-17.78; P$102 7.62,-17.78; P$103 10.16,-17.78; P$104 12.7,-17.78; P$105 15.24,-17.78; P$106 17.78,-17.78; P$107 20.32,-17.78; P$108 22.86,-17.78; P$109 25.4,-17.78; P$110 27.94,-17.78; P$111 30.48,-17.78; P$112 33.02,-17.78; P$113 0,-20.32; P$114 2.54,-20.32; P$115 5.08,-20.32; P$116 7.62,-20.32; P$117 10.16,-20.32; P$118 12.7,-20.32; P$119 15.24,-20.32; P$120 17.78,-20.32; P$121 20.32,-20.32; P$122 22.86,-20.32; P$123 25.4,-20.32; P$124 27.94,-20.32; P$125 30.48,-20.32; P$126 33.02,-20.32; P$127 0,-22.86; P$128 2.54,-22.86; P$129 5.08,-22.86; P$130 7.62,-22.86; P$131 10.16,-22.86; P$132 12.7,-22.86; P$133 15.24,-22.86; P$134 17.78,-22.86; P$135 20.32,-22.86; P$136 22.86,-22.86; P$137 25.4,-22.86; P$138 27.94,-22.86; P$139 30.48,-22.86; P$140 33.02,-22.86; P$141 0,-25.4; P$142 2.54,-25.4; P$143 5.08,-25.4; P$144 7.62,-25.4; P$145 10.16,-25.4; P$146 12.7,-25.4; P$147 15.24,-25.4; P$148 17.78,-25.4; P$149 20.32,-25.4; P$150 22.86,-25.4; P$151 25.4,-25.4; P$152 27.94,-25.4; P$153 30.48,-25.4; P$154 33.02,-25.4; P$155 0,-27.94; P$156 2.54,-27.94; P$157 5.08,-27.94; P$158 7.62,-27.94; P$159 10.16,-27.94; P$160 12.7,-27.94; P$161 15.24,-27.94; P$162 17.78,-27.94; P$163 20.32,-27.94; P$164 22.86,-27.94; P$165 25.4,-27.94; P$166 27.94,-27.94; P$167 30.48,-27.94; P$168 33.02,-27.94; P$169 0,-30.48; P$170 2.54,-30.48; P$171 5.08,-30.48; P$172 7.62,-30.48; P$173 10.16,-30.48; P$174 12.7,-30.48; P$175 15.24,-30.48; P$176 17.78,-30.48; P$177 20.32,-30.48; P$178 22.86,-30.48; P$179 25.4,-30.48; P$180 27.94,-30.48; P$181 30.48,-30.48; P$182 33.02,-30.48

### Placement (x,y rotation side)
B1  19.05,85.55 90 top
B2  105.41,85.55 90 top
B3  127,85.55 90 top
B4  148.59,85.55 90 top
B5  40.64,85.55 90 top
B6  62.23,85.55 90 top
B7  83.82,85.55 90 top
C01  100.33,13.16 180 top
C02  93.98,8.08 270 top
C03  76.2,10.62 90 top
C04  71.12,10.62 90 top
C5  156.21,96.98 90 top
C06  26.67,96.98 90 top
C07  8.89,102.06 180 top
C8  11.43,60.15 0 top
C9  138.43,102.06 180 top
C10  134.62,96.98 90 top
C11  116.84,102.06 180 top
C12  113.03,96.98 90 top
C13  95.25,102.06 180 top
C14  91.44,96.98 90 top
C15  73.66,102.06 180 top
C16  69.85,96.98 90 top
C17  52.07,102.06 180 top
C18  48.26,96.98 90 top
C19  30.48,102.06 180 top
C20  105.41,53.8 180 top
J1  118.11,20.78 270 top
J2  22.86,102.06 180 top
J3  49.49,29.92 0 top
J7  99.06,6.81 0 top
J8  87.63,102.06 180 top
J9  66.04,102.06 180 top
J10  44.45,102.06 180 top
J11  109.22,102.06 180 top
J12  130.81,102.06 180 top
J13  152.4,102.06 180 top
R01  20.32,38.56 180 top
R02  20.32,41.1 180 top
R04  20.32,36.02 0 top
R05  20.32,48.72 0 top
R06  20.32,43.64 180 top
R07  20.32,46.18 180 top
S01  10.16,36.02 270 top
S02  22.86,10.62 0 top
S03  52.96,10.62 0 top
SV1  11.43,66.5 90 top
T1  29.97,36.02 90 top
U$1  80.01,41.83 180 top
U$2  125.73,45.47 0 top

### Tracks (layer width: path | path; a pad name or v marks a point on that pad's centre or on a via)
+3V3
  pour Top (isolate 0.254): 170.18,116.84 -15.24,116.84 -15.24,-5.08 170.18,-5.08
+12V  (via drill 0.35 pad 1.3)
  Bottom 0.813: C07.+ B1.VM | C9.+ B4.VM | C17.+ B6.VM
  Bottom 1.27: B5.VM C19.+ 31.75,107.14 | B6.VM 53.34,107.14 | B7.VM C15.+ 74.93,107.14 | B2.VM C13.+ 96.52,107.14 | B3.VM C11.+ 118.11,107.14 | 139.7,107.14 B4.VM | B1.VM 10.16,107.14 | S03.6 69.85,9.35 C04.1 74.93,8.08 C03.+
  Bottom 2.54: 139.7,107.14 118.11,107.14 96.52,107.14 74.93,107.14 53.34,107.14 31.75,107.14 10.16,107.14 v6.35,107.14 2.29,107.14 2.29,7.06 6.06,3.29 54.9,3.29 60.46,8.85 S03.5 S03.6
BUTTONSTATE
  Top 0.61: R07.1 43.82,46.18 46,44 50,44 52.07,46.07 U$1.31/A12
  Bottom 0.61: R06.1 R07.1
CS1  (via drill 0.35 pad 1.3)
  Top 0.813: v147.32,66.5 v147.32,55.07
  Bottom 0.813: B4.CFG3 v147.32,66.5 | U$1.23/A9 100.33,25.86 117.68,25.86 117.68,51.54 128,51.54 128,55 128.07,55.07 v147.32,55.07
CS2  (via drill 0.35 pad 1.3)
  Top 0.813: v102.87,28.4 v97.79,28.4 | v125.73,67.77 v125.73,55.07
  Bottom 0.813: v97.79,28.4 U$1.22/A8 | B3.CFG3 v125.73,67.77 | v102.87,28.4 115.7,28.4 115.7,53.14 125.75,53.14 125.75,55.05 v125.73,55.07
CS3  (via drill 0.35 pad 1.3)
  Top 0.813: v104.14,71.58 104.14,61.42 99.69,56.98 99.06,56.34 96.52,53.8 v57.15,53.8 | v95.25,28.4 v75.66,28.4 | v52.07,53.8 v44.45,53.8
  Bottom 0.813: B2.CFG3 v104.14,71.58 | v44.45,53.8 44.45,25.4 72.66,25.4 v75.66,28.4 | v95.25,28.4 U$1.21/A7 | v57.15,53.8 v52.07,53.8
CS4  (via drill 0.35 pad 1.3)
  Top 0.813: v92.71,23.86 v73.66,23.86 | v50.8,58.88 43.18,58.88 v41.91,57.61 | v59.69,58.88 v80.01,58.88
  Bottom 0.813: v41.91,57.61 41.91,23.86 72.66,23.86 v73.66,23.86 | U$1.20/A6 v92.71,23.86 | B7.CFG3 v82.55,70.94 82.55,61.42 v80.01,58.88 | v50.8,58.88 v59.69,58.88
CS5  (via drill 0.35 pad 1.3)
  Top 0.813: v85.09,22.32 v75.66,22.32 | v39.37,58.88 50.8,70.31 v60.96,70.31
  Bottom 0.813: B6.CFG3 v60.96,70.31 | v39.37,58.88 39.37,22.32 v75.66,22.32 | U$1.17/A3 v85.09,22.32
CS6  (via drill 0.35 pad 1.3)
  Top 0.813: v39.37,70.31 39.37,67.77 34.29,62.69 v34.29,60.15 | v82.55,16.24 v73.66,16.24
  Bottom 0.813: U$1.16/A2 v82.55,16.24 | v34.29,60.15 34.29,19.24 70.66,19.24 v73.66,16.24 | v39.37,70.31 B5.CFG3
CS7  (via drill 0.35 pad 1.3)
  Top 0.813: v80.01,18.78 v75.66,18.78
  Bottom 0.813: U$1.15/A1 v80.01,18.78 | B1.CFG3 17.78,66.5 31.75,66.5 36.83,61.42 36.83,20.78 73.66,20.78 v75.66,18.78
DIR1
  Bottom 0.813: U$1.2 100.33,57.61 157.48,57.61 B4.DIR
DIR2
  Bottom 0.813: U$1.4/CANRX 95.25,57.61 100.33,62.69 135.89,62.69 B3.DIR
DIR3
  Bottom 0.813: B2.DIR 114.3,67.77 100.33,67.77 90.17,57.61 U$1.6
DIR4
  Bottom 0.813: U$1.8 85.09,57.61 92.71,65.23 B7.DIR
DIR5
  Bottom 0.813: U$1.24/A10 69.85,67.77 71.12,67.77 B6.DIR
DIR6
  Bottom 0.813: B5.DIR 49.53,70.31 55.88,63.96 64.77,63.96 U$1.26/12
DIR7
  Bottom 0.813: U$1.28 59.69,56.34 49.53,56.34 34.29,71.58 27.94,71.58 B1.DIR
ENABLE  (via drill 0.35 pad 1.3)
  Top 0.813: B4.EN 139.7,76.66 118.11,76.66 | 118.11,76.66 B3.EN | 118.11,76.66 96.52,76.66 | 96.52,76.66 B2.EN | 96.52,76.66 74.93,76.66 | 74.93,76.66 B7.EN | 74.93,76.66 v53.34,76.66 | v53.34,76.66 31.75,76.66 | B5.EN 31.75,76.66 | 31.75,76.66 10.16,76.66 B1.EN | U$1.30 v54.61,67.77 | B6.EN v53.34,76.66
  Bottom 0.813: v54.61,67.77 53.34,69.04 v53.34,76.66
GND  (via drill 0.35 pad 1.3)
  Top 0.61: v111.46,51 v111.46,15
  Bottom 0.61: R05.1 R07.2
  pour Bottom (isolate 0.254): -7.62,119.38 173.99,119.38 173.99,-6.35 -7.62,-6.35
  cutout Top (isolate 0.254): 73.66,105.87 88.9,105.87 88.9,90.63 73.66,90.63
GND1
  cutout Top (isolate 0.254): 52.07,105.87 67.31,105.87 67.31,90.63 52.07,90.63
GND2
  cutout Top (isolate 0.254): 30.48,105.87 45.72,105.87 45.72,90.63 30.48,90.63
GND3
  cutout Top (isolate 0.254): 8.89,105.87 24.13,105.87 24.13,90.63 8.89,90.63
GND4
  cutout Top (isolate 0.254): 138.43,105.87 153.67,105.87 153.67,90.63 138.43,90.63
GND5
  cutout Top (isolate 0.254): 116.84,105.87 132.08,105.87 132.08,90.63 116.84,90.63
GND6
  cutout Top (isolate 0.254): 95.25,105.87 110.49,105.87 110.49,90.63 95.25,90.63
MISO  (via drill 0.35, 0.35 pad 1.3)
  Top 0.813: v85.09,72.85 v63.5,72.85 v41.91,72.85 v20.32,72.85 17.78,72.85 17.78,63.96 SV1.1 | v149.86,72.85 v128.27,72.85 v106.68,72.85 v85.09,72.85 | v85.09,72.85 v74.93,72.85
  Bottom 0.813: B4.NC/CFG0 v149.86,72.85 | v63.5,72.85 B6.NC/CFG0 | v85.09,72.85 B7.NC/CFG0 | v106.68,72.85 B2.NC/CFG0 | v128.27,72.85 B3.NC/CFG0 | U$1.12/MISO v74.93,72.85 | v20.32,72.85 B1.NC/CFG0 | v41.91,72.85 B5.NC/CFG0
MOSI  (via drill 0.35 pad 1.3)
  Top 0.813: v142.24,75.39 v120.65,75.39 v99.06,75.39 v77.47,75.39 v55.88,75.39 v34.29,75.39 v12.7,75.39 7.62,75.39 7.62,66.5 SV1.4
  Bottom 0.813: B4.CFG1 v142.24,75.39 | v120.65,75.39 B3.CFG1 | v99.06,75.39 B2.CFG1 | B7.CFG1 v77.47,75.39 U$1.11/MOSI | v55.88,75.39 B6.CFG1 | v34.29,75.39 B5.CFG1 | v12.7,75.39 B1.CFG1
N$1
  Bottom 1.27: B1.M2B J2.4
N$2
  Bottom 1.27: J2.3 B1.M2A
N$3
  Bottom 1.27: J2.2 B1.M1A
N$5
  Bottom 0.508: S01.1 8.89,41.1 R02.2
  Bottom 0.61: R06.2 R02.2
N$7
  Bottom 1.27: J2.1 B1.M1B
N$8
  Bottom 1.27: U$1.33/A14 49.53,29.96 J3.1
N$9
  Bottom 1.27: U$1.34/A15 52.07,29.96 J3.2
N$10
  Bottom 1.27: U$1.35/A16 54.61,29.96 J3.3
N$11
  Bottom 1.27: U$1.36/A17 57.15,29.96 J3.4
N$12
  Bottom 1.27: U$1.37/A18 59.69,29.96 J3.5
N$13
  Bottom 1.27: U$1.38/A19 62.19,34.17 J3.6
N$14
  Bottom 1.27: J11.4 B2.M2B
N$15
  Bottom 1.27: J11.3 B2.M2A
N$16
  Bottom 1.27: J11.2 B2.M1A
N$17
  Bottom 1.27: J11.1 B2.M1B
N$18
  Bottom 1.27: J12.4 B3.M2B
N$19
  Bottom 1.27: J12.3 B3.M2A
N$20
  Bottom 1.27: J12.2 B3.M1A
N$21
  Bottom 1.27: J12.1 B3.M1B
N$22
  Bottom 1.27: J13.4 B4.M2B
N$23
  Bottom 1.27: J13.3 B4.M2A
N$24
  Bottom 1.27: J13.2 B4.M1A
N$25
  Bottom 1.27: J13.1 B4.M1B
N$26
  Bottom 1.27: J10.4 B5.M2B
N$27
  Bottom 1.27: B5.M2A J10.3
N$28
  Bottom 1.27: J10.2 B5.M1A
N$29
  Bottom 1.27: B5.M1B J10.1
N$30
  Bottom 1.27: J9.4 B6.M2B
N$31
  Bottom 1.27: J9.3 B6.M2A
N$32
  Bottom 1.27: J9.2 B6.M1A
N$33
  Bottom 1.27: J9.1 B6.M1B
N$34
  Bottom 1.27: J8.4 B7.M2B
N$35
  Bottom 1.27: J8.3 B7.M2A
N$36
  Bottom 1.27: J8.2 B7.M1A
N$37
  Bottom 1.27: J8.1 B7.M1B
N$38
  Bottom 1.27: U$1.39/A20 64.77,29.96 J3.7
N$39
  Bottom 1.27: U$1.21/DAC0 67.27,34.17 J3.8
N$40
  Bottom 1.27: U$1.A22/DAC1 69.85,29.96 J3.9
N$41  (1 unrouted)
  Bottom 0.813: R02.1 R01.1 R04.2
SCK  (via drill 0.35 pad 1.3)
  Top 0.813: v144.78,74.12 v123.19,74.12 v101.6,74.12 v80.01,74.12 v58.42,74.12 v36.83,74.12 v15.24,74.12 15.24,66.5 SV1.3 | v123.19,67.77 v123.19,55.07
  Bottom 0.813: B4.CFG2 v144.78,74.12 | B3.CFG2 v123.19,74.12 v123.19,67.77 | v36.83,74.12 B5.CFG2 | v58.42,74.12 B6.CFG2 | v80.01,74.12 B7.CFG2 | v101.6,74.12 B2.CFG2 | v15.24,74.12 B1.CFG2 | U$1.13/SCK 74.93,41.1 113.65,41.1 113.65,55 113.72,55.07 v123.19,55.07
SCL1
  Bottom 0.813: U$1.19/A5/SCL 90.17,22.05 91.44,20.78 J1.1
SDA1
  Bottom 0.813: U$1.18/A4/SDA 87.63,19.51 88.9,18.24 J1.2
SHUTDOWN
  Top 0.61: U$1.32/A13 48.8,48.72 R05.2 21.72,48.72 20,47 20,38 18.02,36.02 R04.1
STEP1
  Bottom 0.813: U$1.3/CANTX 97.79,57.61 100.33,60.15 154.94,60.15 B4.STEP
STEP2
  Bottom 0.813: U$1.5 92.71,57.61 100.33,65.23 133.35,65.23 B3.STEP
STEP3
  Bottom 0.813: B2.STEP 111.76,70 100.03,70 87.63,57.61 U$1.7
STEP4
  Bottom 0.813: U$1.9/CS 82.55,57.61 90.17,65.23 B7.STEP
STEP5
  Bottom 0.813: U$1.25/A11 67.31,70.31 68.58,70.31 B6.STEP
STEP6
  Bottom 0.813: B5.STEP 46.99,69.04 54.61,61.42 62.23,61.42 U$1.27/A13
STEP7
  Bottom 0.813: U$1.29 57.15,51.26 50.8,51.26 33.02,69.04 26.67,69.04 25.4,70.31 B1.STEP
V_DAUER
  Bottom 0.508: S01.2 12.62,33.52 25.36,20.78 S02.4
VCONTROL
  Bottom 0.508: T1.3 29.97,9.74 S02.5

### Text on the board
tPlace: M7 | M6 | M5 | M4 | M3 | M2 | M1 | Thomas Reiter
tNames: SPI | Power / switch | GPIO | GND | 3,3V | GND | V-Standby | V-Controll | 3,3V | 12V | I2C